# Altium project keyboard.PrjPcb
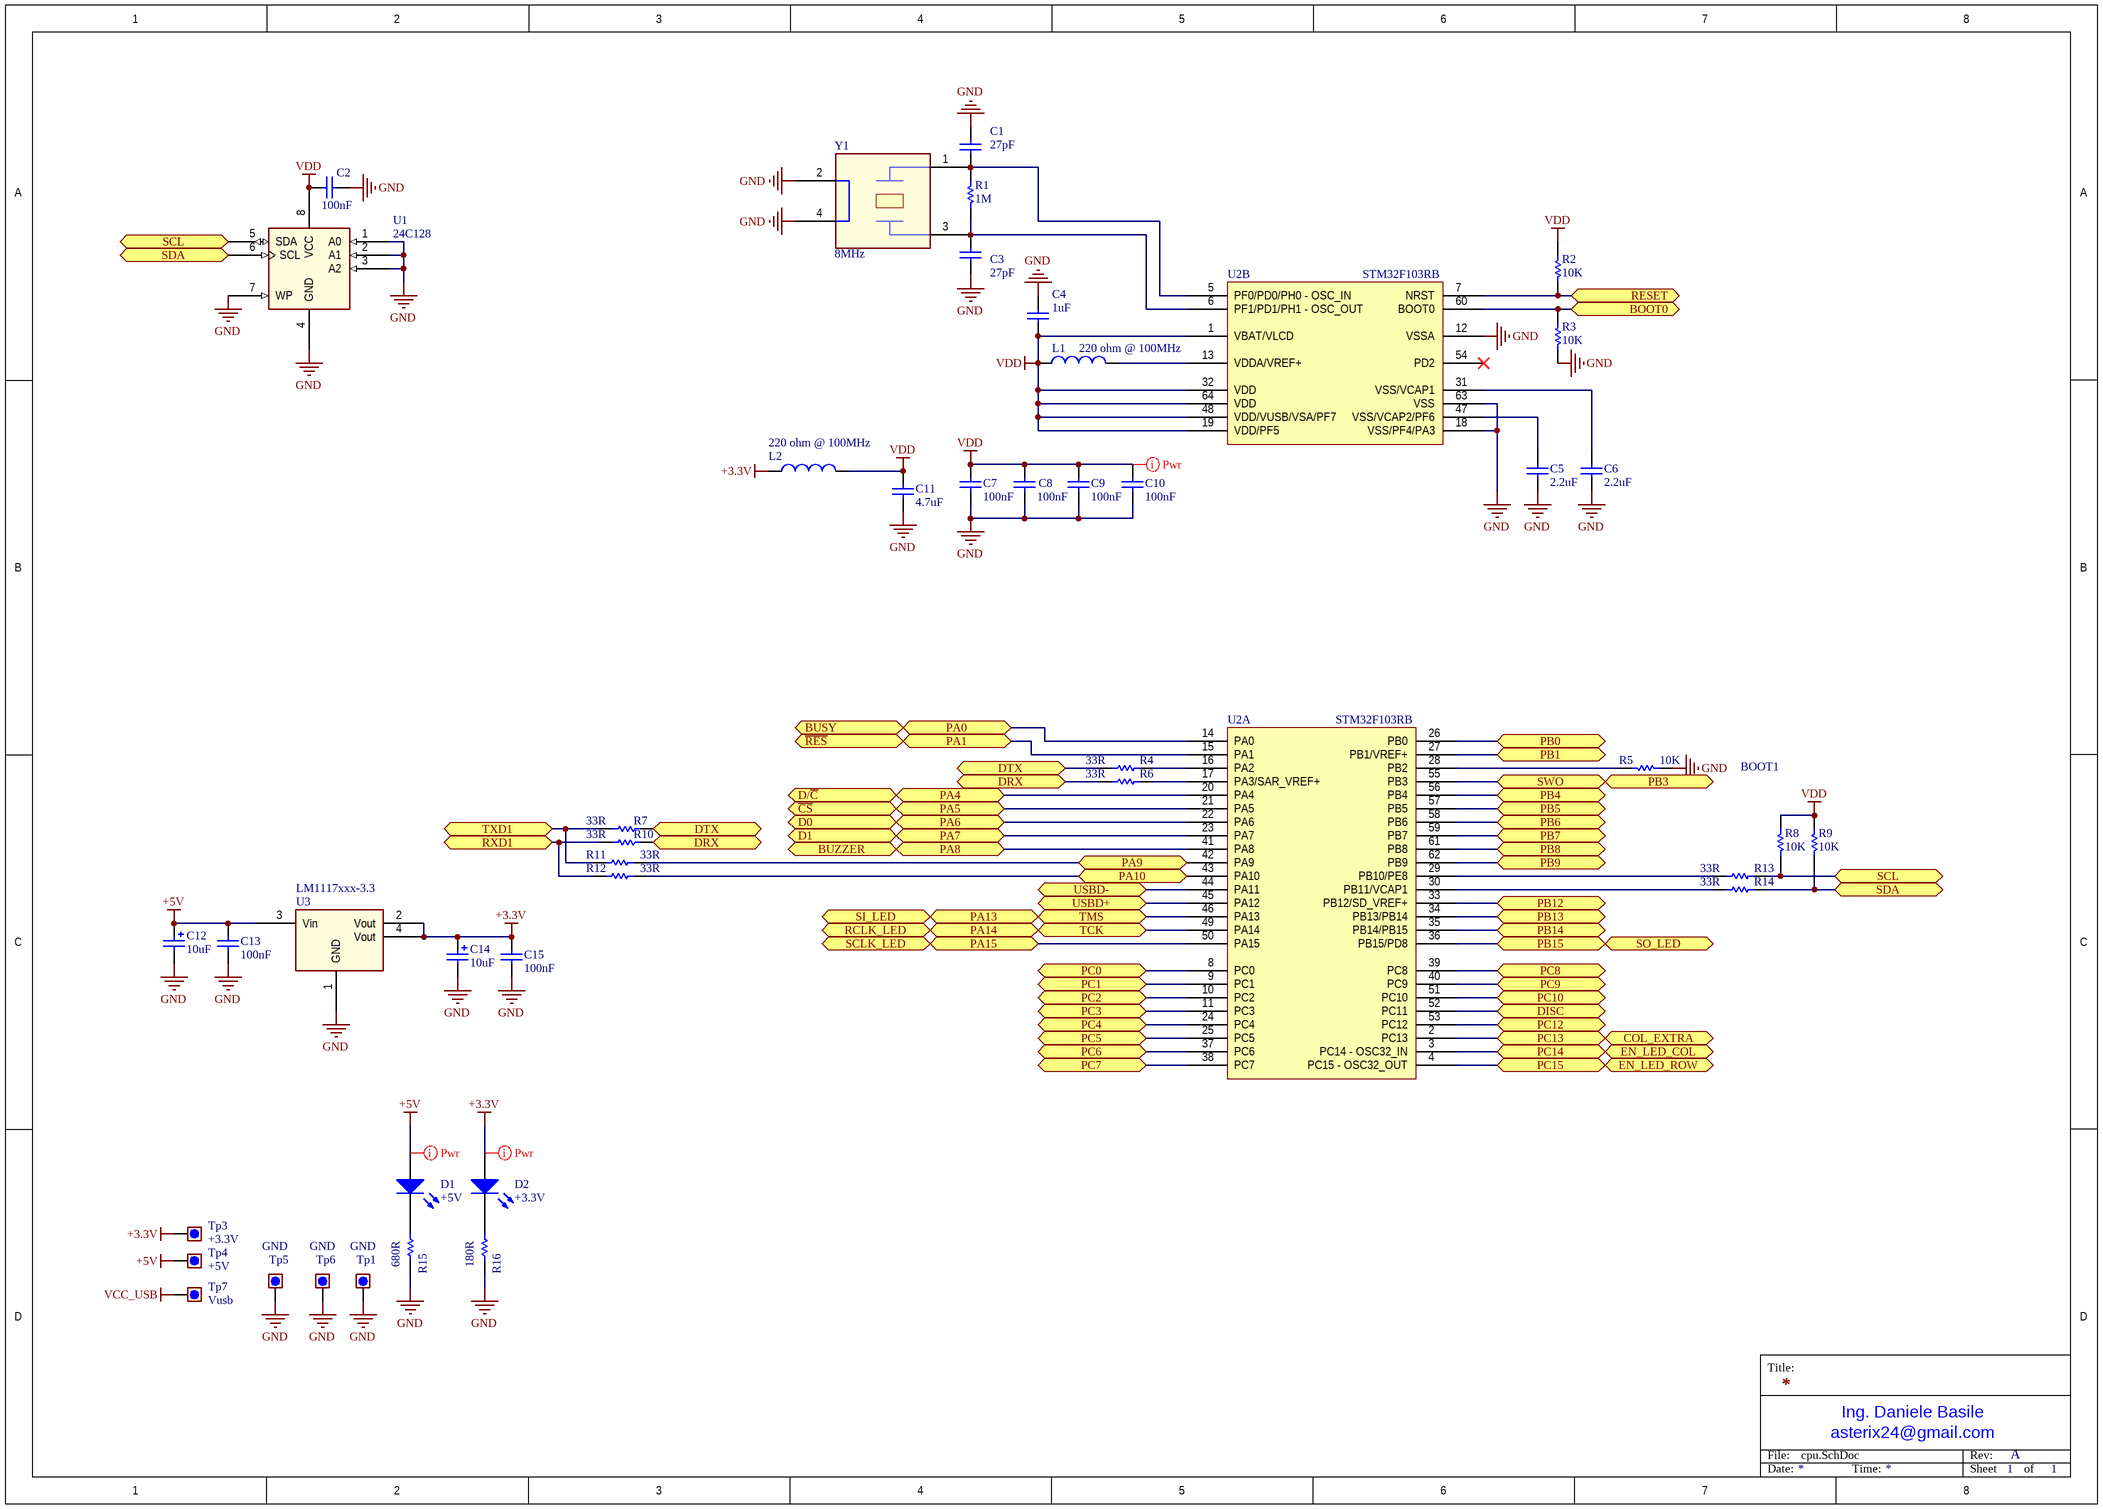
[diagram p0: cpu.SchDoc]
3 sheets, 187 parts. Net scope: flat (ports and power ports of the same name join across sheets).
Board file: keyboard.PcbDoc
Sheets:
  cpu.SchDoc
  keymap.SchDoc
  led.SchDoc

## Sheet cpu.SchDoc
size A3; Organization: Develer s.r.l.; Address1: via Mugellese 1/A; Address2: 50019 Campi Bisenzio; Address3: Firenze; Address4: ITALY; Revision: A; SheetNumber: 1; SheetTotal: 1

### Parts
C1  27pF  [0603_[1608]]
C2  100nF  [0603_[1608]]
C3  27pF  [0603_[1608]]
C4  1uF  [0603_[1608]]
C5  2.2uF  [0603_[1608]]
C6  2.2uF  [0603_[1608]]
C7  100nF  [0603_[1608]]
C8  100nF  [0603_[1608]]
C9  100nF  [0603_[1608]]
C10  100nF  [0603_[1608]]
C11  4.7uF  [0603_[1608]]
C12  10uF  [1206_[3216]]
C13  100nF  [0603_[1608]]
C14  10uF  [1206_[3216]]
C15  100nF  [0603_[1608]]
D1  +5V  [0603_[1608]_K2-A1_LED]
D2  +3.3V  [0603_[1608]_K2-A1_LED]
L1  220 ohm @ 100MHz  [0805_[2012]]
L2  220 ohm @ 100MHz  [0805_[2012]]
R1  1M  [0603_[1608]]
R2  10K  [0603_[1608]]
R3  10K  [0603_[1608]]
R4  33R  [0603_[1608]]
R5  10K  [0603_[1608]]
R6  33R  [0603_[1608]]
R7  33R  [0603_[1608]]
R8  10K  [0603_[1608]]
R9  10K  [0603_[1608]]
R10  33R  [0603_[1608]]
R11  33R  [0603_[1608]]
R12  33R  [0603_[1608]]
R13  33R  [0603_[1608]]
R14  33R  [0603_[1608]]
R15  680R  [0603_[1608]]
R16  180R  [0603_[1608]]
Tp1  GND  [TEST_POINT_THD_D1.8MM]  (no BOM)
Tp3  +3.3V  [TEST_POINT_THD_D1.8MM]  (no BOM)
Tp4  +5V  [TEST_POINT_THD_D1.8MM]  (no BOM)
Tp5  GND  [TEST_POINT_THD_D1.8MM]  (no BOM)
Tp6  GND  [TEST_POINT_THD_D1.8MM]  (no BOM)
Tp7  Vusb  [TEST_POINT_THD_D1.8MM]  (no BOM)
U1  24C128  [SOIC8]
U2  STM32F103RB  [TSQFP50P1200X1200X160-64N]  (parts A,B of 2)
U3  LM1117xxx-3.3  [SOT-223]
Y1  8MHz  [CRYSTAL_3.2X2.5MM_4P_SMD]

### Ports
BOOT0, BUSY, BUZZER, COL_EXTRA, D0, D1, D/~{C}, DISC, DRX, DTX, EN_LED_COL, EN_LED_ROW, PA0, PA1, PA4, PA5, PA6, PA7, PA8, PA9, PA10, PA13, PA14, PA15, PB0, PB1, PB3, PB4, PB5, PB6, PB7, PB8, PB9, PB12, PB13, PB14, PB15, PC0, PC1, PC2, PC3, PC4, PC5, PC6, PC7, PC8, PC9, PC10, PC12, PC13, PC14, PC15, RCLK_LED, RESET, RXD1, SCL, SCLK_LED, SDA, SI_LED, SO_LED, SWO, TCK, TMS, TXD1, USBD+, USBD-, ~{CS}, ~{RES}

### Nets
+3.3V: C14.1 C15.2 D2.1(A) L2.1 Tp3.1 U3.2(Vout) U3.4(Vout)
+5V: C12.1 C13.2 D1.1(A) Tp4.1 U3.3(Vin)
GND: C1.2 C2.1 C3.2 C4.2 C5.1 C6.1 C7.2 C8.2 C9.2 C10.2 C11.1 C12.2 C13.1 C14.2 C15.1 R3.1 R5.2 R15.1 R16.1 Tp1.1 Tp5.1 Tp6.1 U1.1(A0) U1.2(A1) U1.3(A2) U1.4(GND) U1.7(WP) U2.12(VSSA) U2.18(VSS/PF4/PA3) U2.63(VSS) U3.1(GND) Y1.2 Y1.4
VCC_USB: Tp7.1
VDD: C2.2 C4.1 C7.1 C8.1 C9.1 C10.1 C11.2 L1.1 L2.2 R2.1 R8.2 R9.2 U1.8(VCC) U2.1(VBAT/VLCD) U2.19(VDD/PF5) U2.32(VDD) U2.48(VDD/VUSB/VSA/PF7) U2.64(VDD)
BOOT0: R3.2 U2.60(BOOT0) ; port BOOT0
BUSY: U2.14(PA0) ; port PA0, port BUSY
BUZZER: U2.41(PA8) ; port PA8, port BUZZER
~{CS}: U2.21(PA5) ; port PA5, port ~{CS}
COL_EXTRA: U2.2(PC13) ; port PC13, port COL_EXTRA
D0: U2.22(PA6) ; port PA6, port D0
D1: U2.23(PA7) ; port PA7, port D1
D/~{C}: U2.20(PA4) ; port PA4, port D/~{C}
DISC: U2.52(PC11) ; port DISC
DRX: R6.2 R10.1 ; port DRX
DTX: R4.2 R7.1 ; port DTX
EN_LED_COL: U2.3(PC14_-_OSC32_IN) ; port PC14, port EN_LED_COL
EN_LED_ROW: U2.4(PC15_-_OSC32_OUT) ; port PC15, port EN_LED_ROW
PA1: U2.15(PA1) ; port PA1, port ~{RES}
PA9: R11.1 U2.42(PA9) ; port PA9
PA10: R12.1 U2.43(PA10) ; port PA10
PA13: U2.46(PA13) ; port TMS, port PA13, port SI_LED
PA14: U2.49(PA14) ; port TCK, port PA14, port RCLK_LED
PA15: U2.50(PA15) ; port PA15, port SCLK_LED
PB0: U2.26(PB0) ; port PB0
PB1: U2.27(PB1/VREF+) ; port PB1
PB3: U2.55(PB3) ; port SWO, port PB3
PB4: U2.56(PB4) ; port PB4
PB5: U2.57(PB5) ; port PB5
PB6: U2.58(PB6) ; port PB6
PB7: U2.59(PB7) ; port PB7
PB8: U2.61(PB8) ; port PB8
PB9: U2.62(PB9) ; port PB9
PB12: U2.33(PB12/SD_VREF+) ; port PB12
PB13: U2.34(PB13/PB14) ; port PB13
PB14: U2.35(PB14/PB15) ; port PB14
PB15: U2.36(PB15/PD8) ; port PB15, port SO_LED
PC0: U2.8(PC0) ; port PC0
PC1: U2.9(PC1) ; port PC1
PC2: U2.10(PC2) ; port PC2
PC3: U2.11(PC3) ; port PC3
PC4: U2.24(PC4) ; port PC4
PC5: U2.25(PC5) ; port PC5
PC6: U2.37(PC6) ; port PC6
PC7: U2.38(PC7) ; port PC7
PC8: U2.39(PC8) ; port PC8
PC9: U2.40(PC9) ; port PC9
PC10: U2.51(PC10) ; port PC10
PC12: U2.53(PC12) ; port PC12
RESET: R2.2 U2.7(NRST) ; port RESET
RXD1: R10.2 R12.2 ; port RXD1
SCL: R8.1 R13.1 U1.5(SDA) ; port SCL
SDA: R9.1 R14.1 U1.6(SCL) ; port SDA
TXD1: R7.2 R11.2 ; port TXD1
USBD+: U2.45(PA12) ; port USBD+
USBD-: U2.44(PA11) ; port USBD-
NetC1_1: C1.1 R1.2 U2.5(PF0/PD0/PH0_-_OSC_IN) Y1.1
NetC3_1: C3.1 R1.1 U2.6(PF1/PD1/PH1_-_OSC_OUT) Y1.3
NetC5_2: C5.2 U2.47(VSS/VCAP2/PF6)
NetC6_2: C6.2 U2.31(VSS/VCAP1)
NetD1_2: D1.2(K) R15.2
NetD2_2: D2.2(K) R16.2
NetL1_2: L1.2 U2.13(VDDA/VREF+)
NetR4_1: R4.1 U2.16(PA2)
NetR5_1: R5.1 U2.28(PB2)
NetR6_1: R6.1 U2.17(PA3/SAR_VREF+)
NetR13_2: R13.2 U2.29(PB10/PE8)
NetR14_2: R14.2 U2.30(PB11/VCAP1)

Not connected (* = marked no-connect by the designer): U2 54(PD2)*

### Layout directives
net class Power: +3.3V, +5V, VDD

### Notes on the sheet
- BOOT1
- Title:
- File:
- asterix24@gmail.com
- Ing. Daniele Basile
- Rev:
- Date:
- Time:
- Sheet
- of

### Library data of the parts
C1 C3 = Cap: Ceramic NP0 +/- 0.1; Value: 10nF; Published: 8-Jun-2000; Revision: July-2002: Re-released for DXP Platform.; Publisher: Altium Limited
C2 C7-C10 = Cap: Ceramic X7R 50V; Value: 10nF; Published: 8-Jun-2000; Revision: July-2002: Re-released for DXP Platform.; Publisher: Altium Limited
C4 C11 = Cap: Ceramic X7R 16V; Value: 10nF; Published: 8-Jun-2000; Revision: July-2002: Re-released for DXP Platform.; Publisher: Altium Limited
C5 C6 = Cap: Ceramic 6.3V X7R; Value: 10nF; Published: 8-Jun-2000; Revision: July-2002: Re-released for DXP Platform.; Publisher: Altium Limited
C12 C14 = Cap Pol1: Ceramic X5R 25V; Published: 8-Jun-2000; Revision: July-2002: Re-released for DXP Platform.; Publisher: Altium Limited; Value: 10uF
C13 C15 = Cap: Ceramic X7R 50V; Value: 100pF; Published: 8-Jun-2000; LatestRevisionDate: 17-Jul-2002; LatestRevisionNote: Re-released for DXP Platform.; PackageReference: RAD-0.3; Publisher: Altium Limited; PackageDescription: Radial Cap, Thru-Hole; 2 Leads; 0.3 in Pin Spacing
D1 D2 = LED0: LED Green; Published: 8-Jun-2000; LatestRevisionDate: 08-Jul-2005; LatestRevisionNote: Mech Layer 1 removed.; PackageReference: LED-0; Publisher: Altium Limited; PackageDescription: LED; 2 Leads
L1 = Inductor: Value: 100uH; Published: 8-Jun-2000; Revision: July-2002: Re-released for DXP Platform.; Publisher: Altium Limited
L2 = Inductor: WE 742792022
R1-R14 = Res1: Resistor; Value: 1K; Published: 8-Jun-2000; Revision: July-2002: Re-released for DXP Platform.; Publisher: Altium Limited
R15 R16 = Res1: Resistor; Revision: July-2002: Re-released for DXP Platform.
Tp1 Tp3-Tp7 = Test_point: Test point
U1 = EEPROM-SOIC8: EEPROM
U3 = LM1117-FIXED-OUT: LM1117 LDO Fixed output
Y1 = CRYSTAL-4p

## Sheet keymap.SchDoc
size A3; Organization: Develer s.r.l.; Address1: via Mugellese 1/A; Address2: 50019 Campi Bisenzio; Address3: Firenze; Address4: ITALY; Revision: A; SheetNumber: 1; SheetTotal: 1
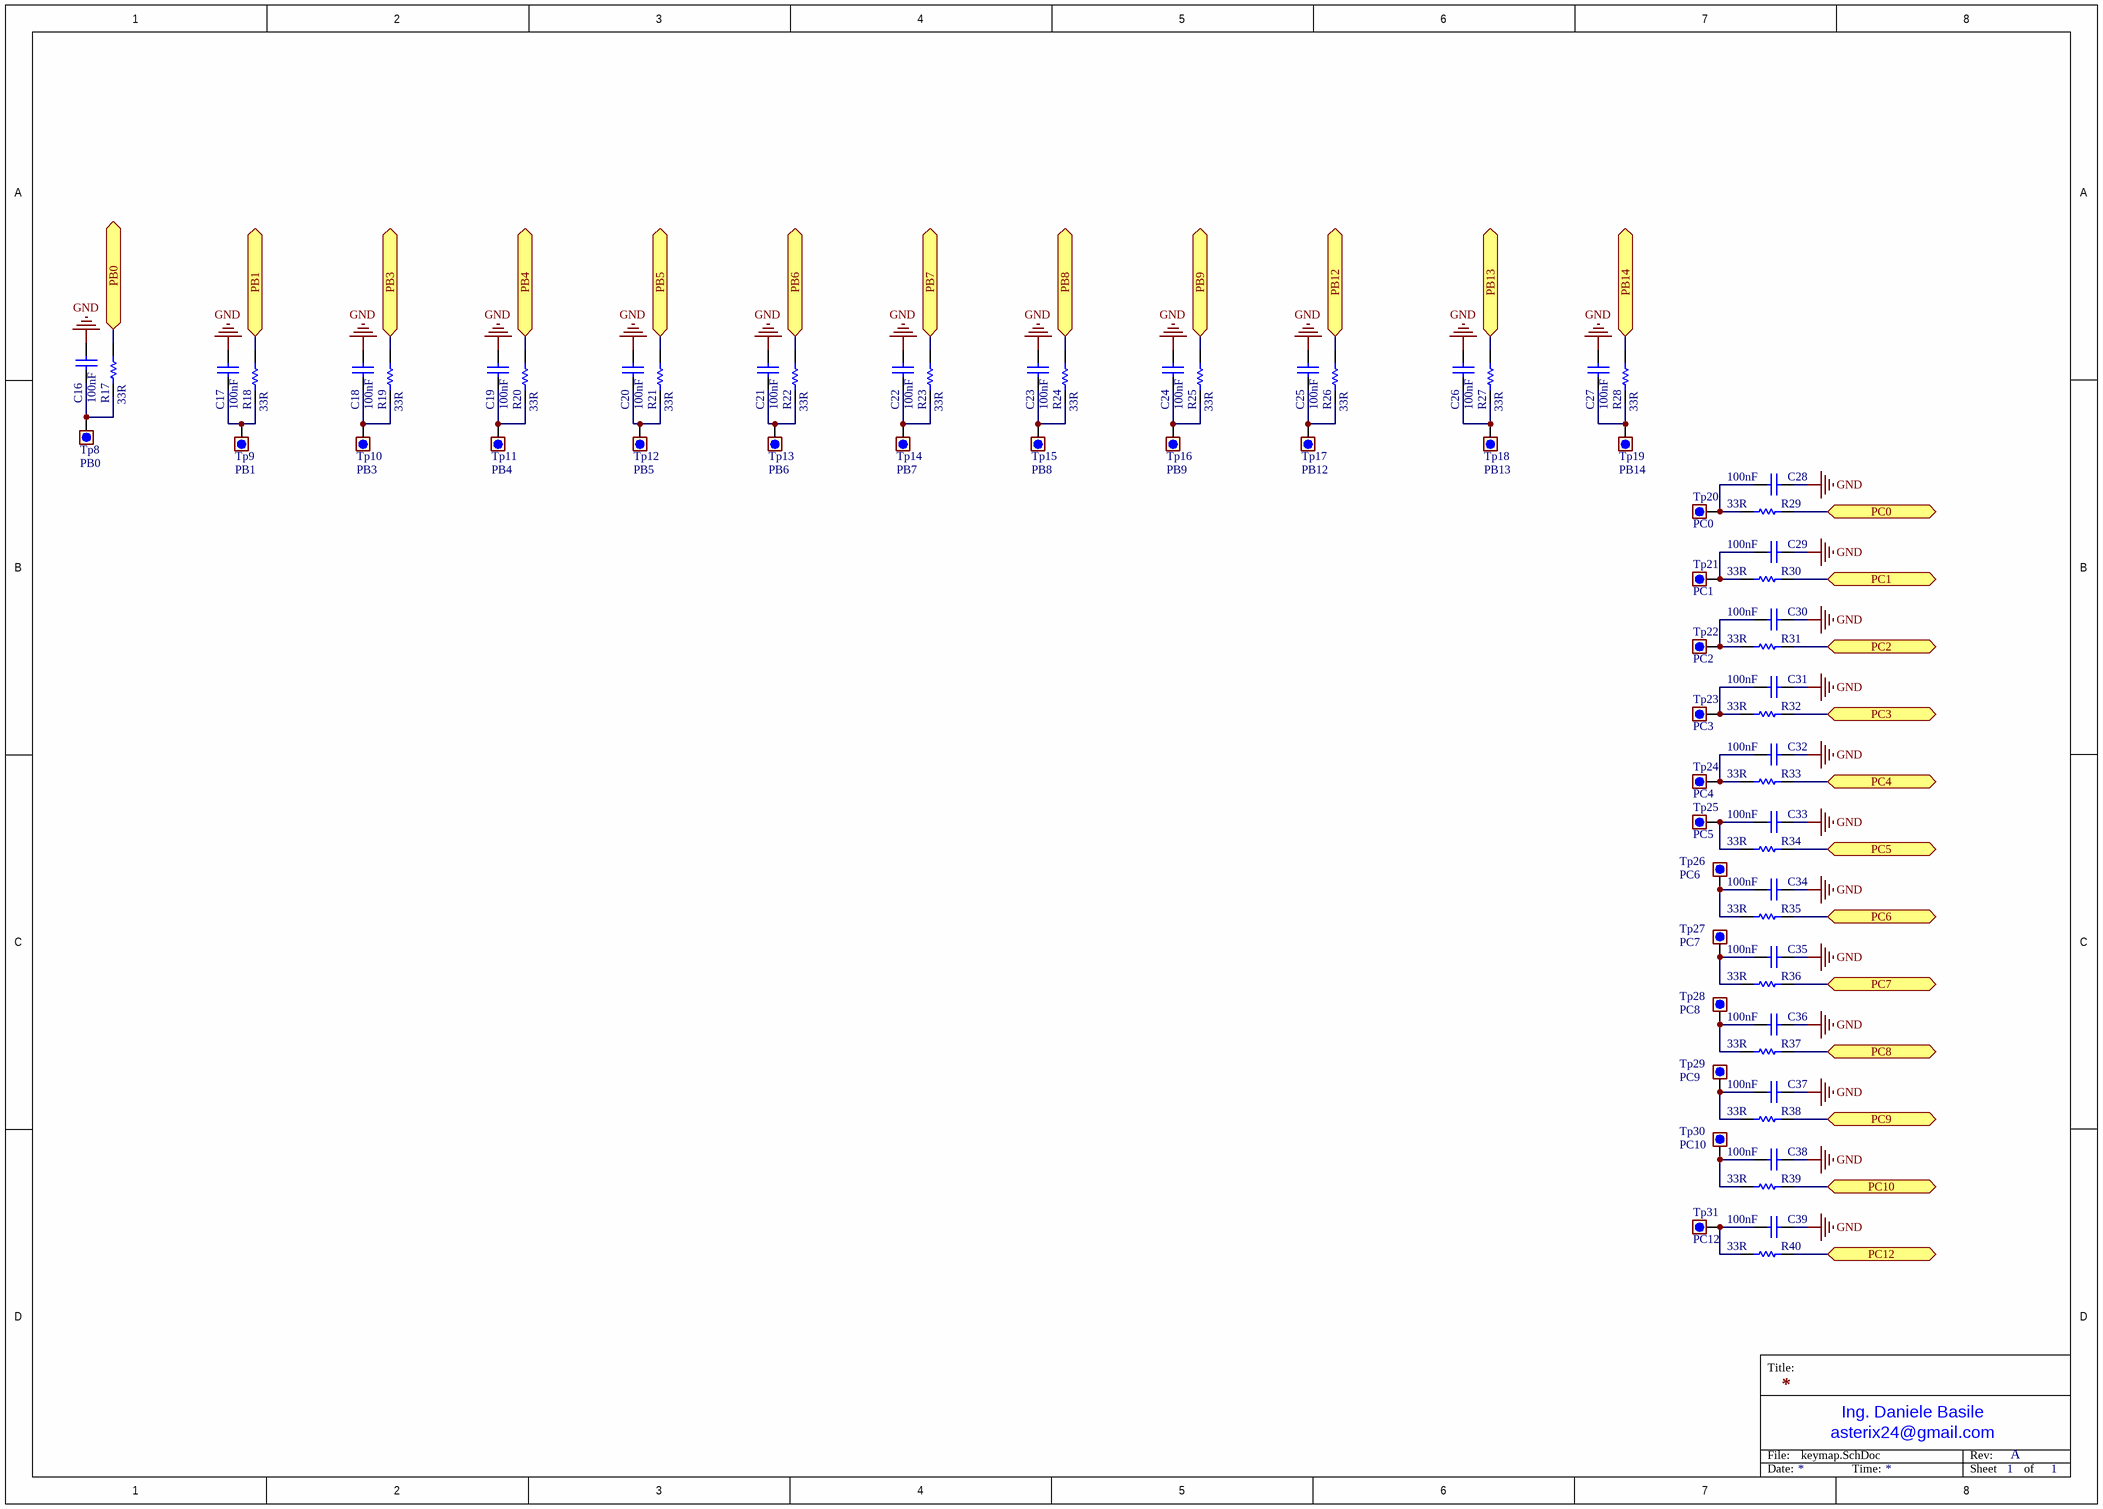
[diagram p1: keymap.SchDoc]

### Parts
C16  100nF  [0603_[1608]]
C17  100nF  [0603_[1608]]
C18  100nF  [0603_[1608]]
C19  100nF  [0603_[1608]]
C20  100nF  [0603_[1608]]
C21  100nF  [0603_[1608]]
C22  100nF  [0603_[1608]]
C23  100nF  [0603_[1608]]
C24  100nF  [0603_[1608]]
C25  100nF  [0603_[1608]]
C26  100nF  [0603_[1608]]
C27  100nF  [0603_[1608]]
C28  100nF  [0603_[1608]]
C29  100nF  [0603_[1608]]
C30  100nF  [0603_[1608]]
C31  100nF  [0603_[1608]]
C32  100nF  [0603_[1608]]
C33  100nF  [0603_[1608]]
C34  100nF  [0603_[1608]]
C35  100nF  [0603_[1608]]
C36  100nF  [0603_[1608]]
C37  100nF  [0603_[1608]]
C38  100nF  [0603_[1608]]
C39  100nF  [0603_[1608]]
R17  33R  [0603_[1608]]
R18  33R  [0603_[1608]]
R19  33R  [0603_[1608]]
R20  33R  [0603_[1608]]
R21  33R  [0603_[1608]]
R22  33R  [0603_[1608]]
R23  33R  [0603_[1608]]
R24  33R  [0603_[1608]]
R25  33R  [0603_[1608]]
R26  33R  [0603_[1608]]
R27  33R  [0603_[1608]]
R28  33R  [0603_[1608]]
R29  33R  [0603_[1608]]
R30  33R  [0603_[1608]]
R31  33R  [0603_[1608]]
R32  33R  [0603_[1608]]
R33  33R  [0603_[1608]]
R34  33R  [0603_[1608]]
R35  33R  [0603_[1608]]
R36  33R  [0603_[1608]]
R37  33R  [0603_[1608]]
R38  33R  [0603_[1608]]
R39  33R  [0603_[1608]]
R40  33R  [0603_[1608]]
Tp8  PB0  [TEST_POINT_THD_D1.6mm_oval]  (no BOM)
Tp9  PB1  [TEST_POINT_THD_D1.6mm_oval]  (no BOM)
Tp10  PB3  [TEST_POINT_THD_D1.6mm_oval]  (no BOM)
Tp11  PB4  [TEST_POINT_THD_D1.6mm_oval]  (no BOM)
Tp12  PB5  [TEST_POINT_THD_D1.6mm_oval]  (no BOM)
Tp13  PB6  [TEST_POINT_THD_D1.6mm_oval]  (no BOM)
Tp14  PB7  [TEST_POINT_THD_D1.6mm_oval]  (no BOM)
Tp15  PB8  [TEST_POINT_THD_D1.6mm_oval]  (no BOM)
Tp16  PB9  [TEST_POINT_THD_D1.6mm_oval]  (no BOM)
Tp17  PB12  [TEST_POINT_THD_D1.6mm_oval]  (no BOM)
Tp18  PB13  [TEST_POINT_THD_D1.6mm_oval]  (no BOM)
Tp19  PB14  [TEST_POINT_THD_D1.6mm_oval]  (no BOM)
Tp20  PC0  [TEST_POINT_THD_D1.6mm_oval]  (no BOM)
Tp21  PC1  [TEST_POINT_THD_D1.6mm_oval]  (no BOM)
Tp22  PC2  [TEST_POINT_THD_D1.6mm_oval]  (no BOM)
Tp23  PC3  [TEST_POINT_THD_D1.6mm_oval]  (no BOM)
Tp24  PC4  [TEST_POINT_THD_D1.6mm_oval]  (no BOM)
Tp25  PC5  [TEST_POINT_THD_D1.6mm_oval]  (no BOM)
Tp26  PC6  [TEST_POINT_THD_D1.6mm_oval]  (no BOM)
Tp27  PC7  [TEST_POINT_THD_D1.6mm_oval]  (no BOM)
Tp28  PC8  [TEST_POINT_THD_D1.6mm_oval]  (no BOM)
Tp29  PC9  [TEST_POINT_THD_D1.6mm_oval]  (no BOM)
Tp30  PC10  [TEST_POINT_THD_D1.6mm_oval]  (no BOM)
Tp31  PC12  [TEST_POINT_THD_D1.6mm_oval]  (no BOM)

### Ports
PB0, PB1, PB3, PB4, PB5, PB6, PB7, PB8, PB9, PB12, PB13, PB14, PC0, PC1, PC2, PC3, PC4, PC5, PC6, PC7, PC8, PC9, PC10, PC12

### Nets
GND: C16.2 C17.2 C18.2 C19.2 C20.2 C21.2 C22.2 C23.2 C24.2 C25.2 C26.2 C27.2 C28.2 C29.2 C30.2 C31.2 C32.2 C33.2 C34.2 C35.2 C36.2 C37.2 C38.2 C39.2
PB0: R17.2 ; port PB0
PB1: R18.2 ; port PB1
PB3: R19.2 ; port PB3
PB4: R20.2 ; port PB4
PB5: R21.2 ; port PB5
PB6: R22.2 ; port PB6
PB7: R23.2 ; port PB7
PB8: R24.2 ; port PB8
PB9: R25.2 ; port PB9
PB12: R26.2 ; port PB12
PB13: R27.2 ; port PB13
PB14: R28.2 ; port PB14
PC0: R29.2 ; port PC0
PC1: R30.2 ; port PC1
PC2: R31.2 ; port PC2
PC3: R32.2 ; port PC3
PC4: R33.2 ; port PC4
PC5: R34.2 ; port PC5
PC6: R35.2 ; port PC6
PC7: R36.2 ; port PC7
PC8: R37.2 ; port PC8
PC9: R38.2 ; port PC9
PC10: R39.2 ; port PC10
PC12: R40.2 ; port PC12
NetC16_1: C16.1 R17.1 Tp8.1
NetC17_1: C17.1 R18.1 Tp9.1
NetC18_1: C18.1 R19.1 Tp10.1
NetC19_1: C19.1 R20.1 Tp11.1
NetC20_1: C20.1 R21.1 Tp12.1
NetC21_1: C21.1 R22.1 Tp13.1
NetC22_1: C22.1 R23.1 Tp14.1
NetC23_1: C23.1 R24.1 Tp15.1
NetC24_1: C24.1 R25.1 Tp16.1
NetC25_1: C25.1 R26.1 Tp17.1
NetC26_1: C26.1 R27.1 Tp18.1
NetC27_1: C27.1 R28.1 Tp19.1
NetC28_1: C28.1 R29.1 Tp20.1
NetC29_1: C29.1 R30.1 Tp21.1
NetC30_1: C30.1 R31.1 Tp22.1
NetC31_1: C31.1 R32.1 Tp23.1
NetC32_1: C32.1 R33.1 Tp24.1
NetC33_1: C33.1 R34.1 Tp25.1
NetC34_1: C34.1 R35.1 Tp26.1
NetC35_1: C35.1 R36.1 Tp27.1
NetC36_1: C36.1 R37.1 Tp28.1
NetC37_1: C37.1 R38.1 Tp29.1
NetC38_1: C38.1 R39.1 Tp30.1
NetC39_1: C39.1 R40.1 Tp31.1

### Notes on the sheet
- Title:
- File:
- asterix24@gmail.com
- Ing. Daniele Basile
- Rev:
- Date:
- Time:
- Sheet
- of

### Library data of the parts
C16-C39 = Cap: Ceramic X7R 50V; Value: 10nF; Published: 8-Jun-2000; Revision: July-2002: Re-released for DXP Platform.; Publisher: Altium Limited
R17-R40 = Res1: Resistor; Value: 1K; Published: 8-Jun-2000; Revision: July-2002: Re-released for DXP Platform.; Publisher: Altium Limited
Tp8-Tp31 = Test_point: Test point

## Sheet led.SchDoc
size A3; Organization: Develer s.r.l.; Address1: via Mugellese 1/A; Address2: 50019 Campi Bisenzio; Address3: Firenze; Address4: ITALY; Revision: A; SheetNumber: 1; SheetTotal: 1
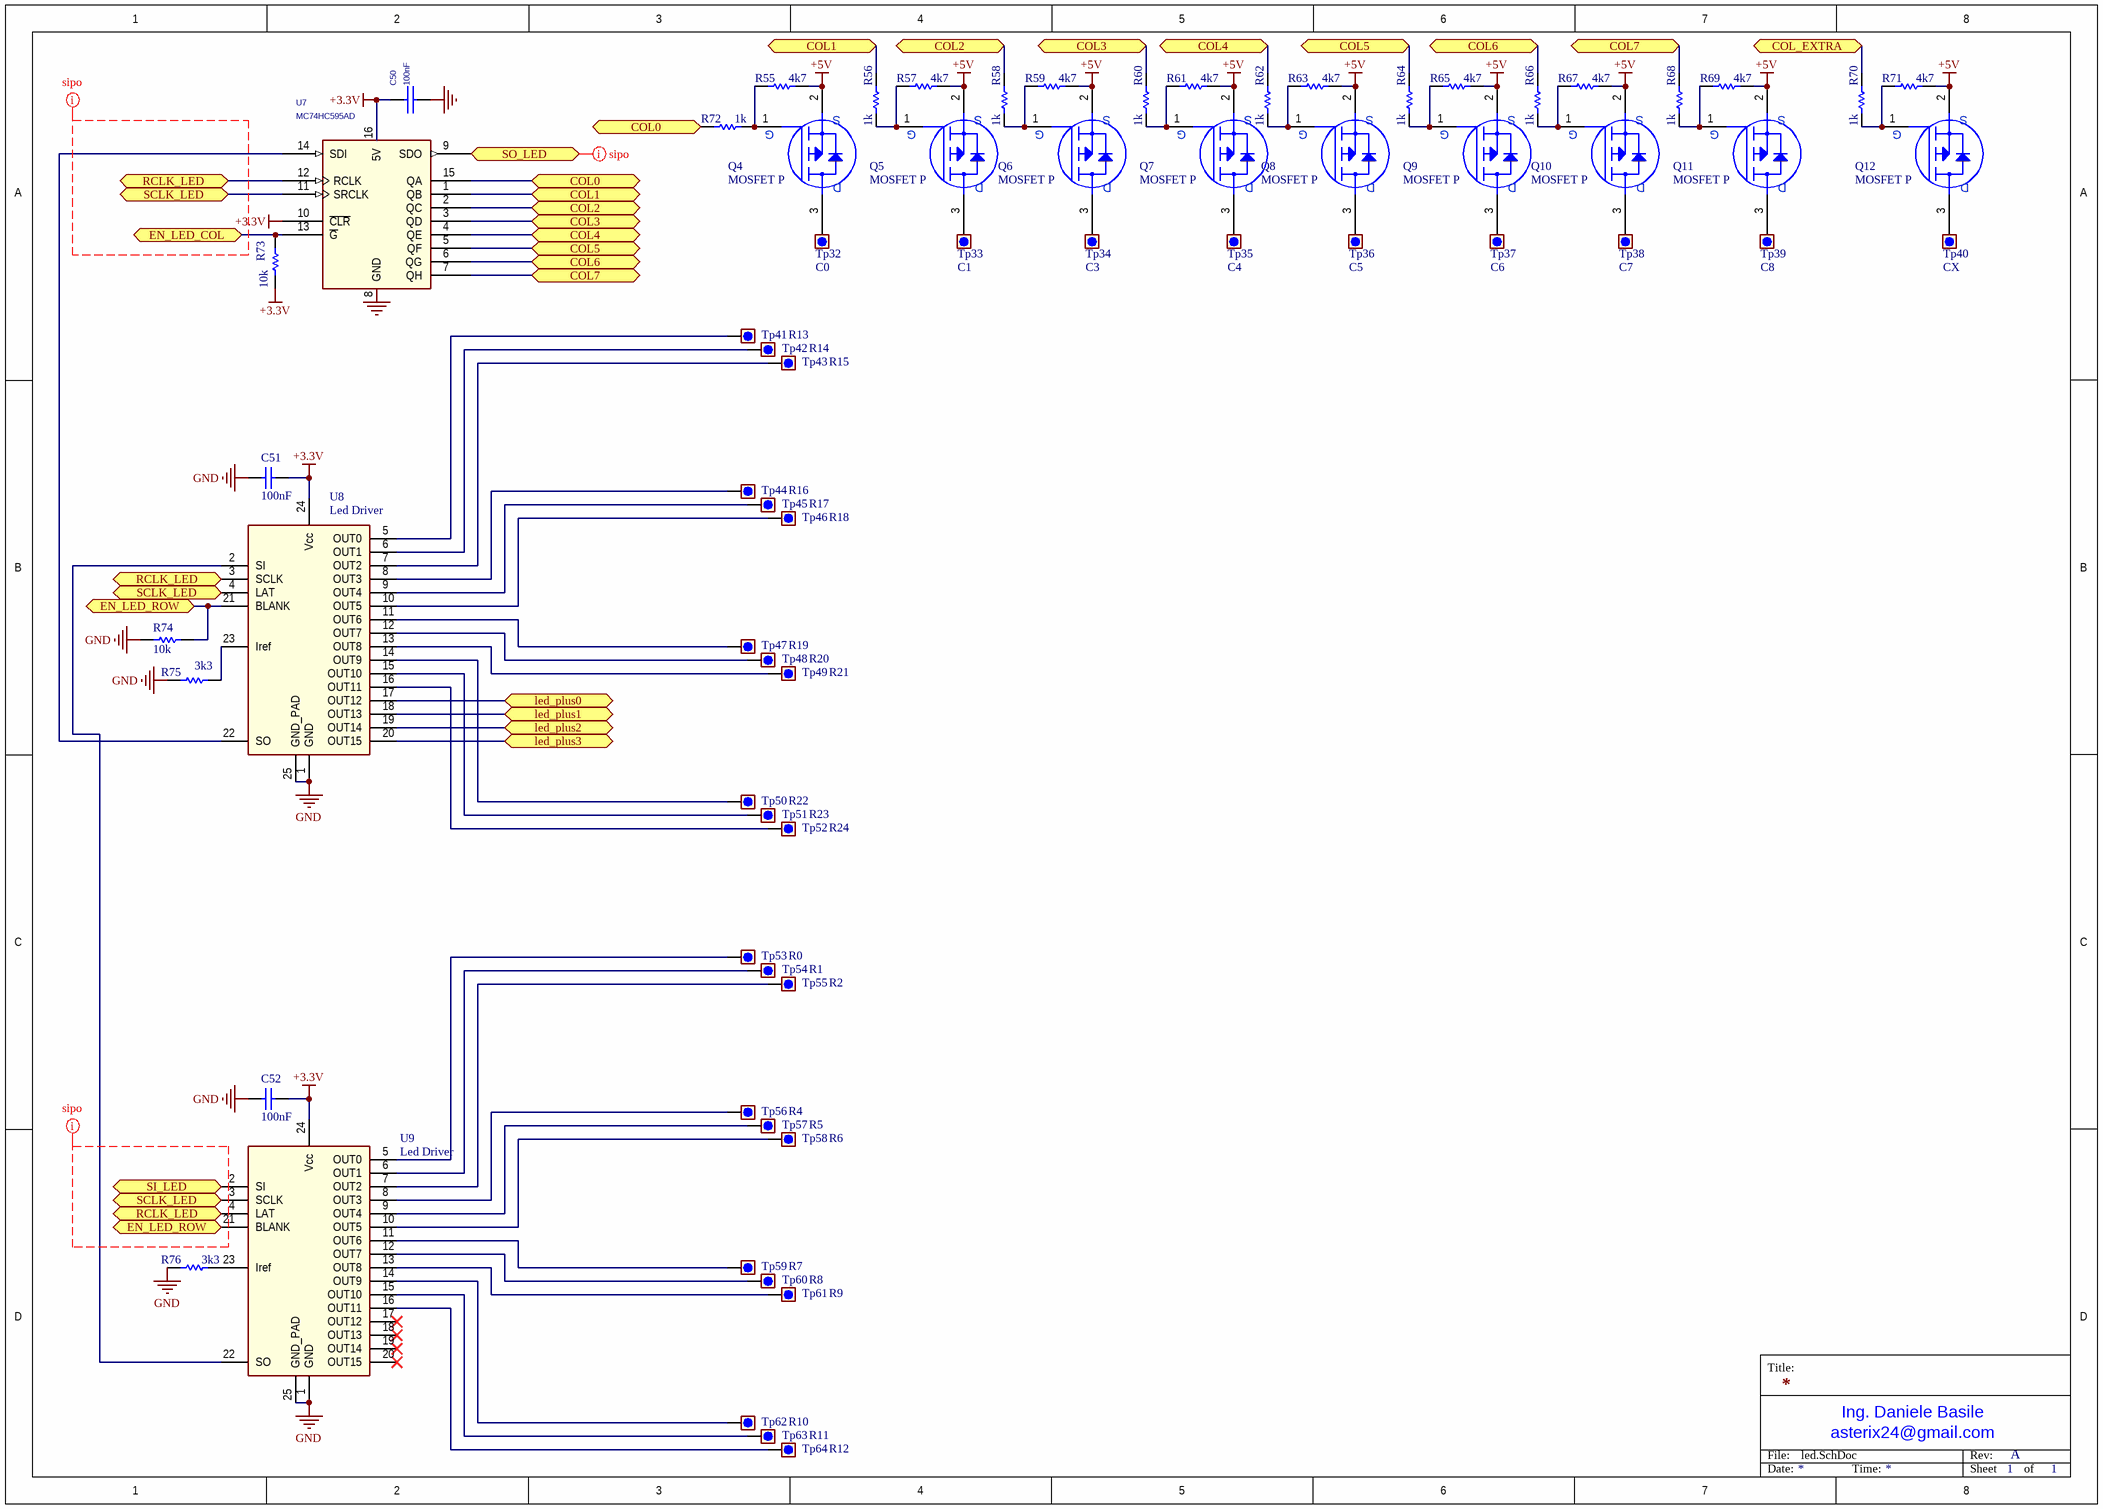
[diagram p2: led.SchDoc]

### Parts
C50  100nF  [0603_[1608]]
C51  100nF  [0603_[1608]]
C52  100nF  [0603_[1608]]
Q4  MOSFET P  [SOT-23]
Q5  MOSFET P  [SOT-23]
Q6  MOSFET P  [SOT-23]
Q7  MOSFET P  [SOT-23]
Q8  MOSFET P  [SOT-23]
Q9  MOSFET P  [SOT-23]
Q10  MOSFET P  [SOT-23]
Q11  MOSFET P  [SOT-23]
Q12  MOSFET P  [SOT-23]
R55  4k7  [0603_[1608]]
R56  1k  [0603_[1608]]
R57  4k7  [0603_[1608]]
R58  1k  [0603_[1608]]
R59  4k7  [0603_[1608]]
R60  1k  [0603_[1608]]
R61  4k7  [0603_[1608]]
R62  1k  [0603_[1608]]
R63  4k7  [0603_[1608]]
R64  1k  [0603_[1608]]
R65  4k7  [0603_[1608]]
R66  1k  [0603_[1608]]
R67  4k7  [0603_[1608]]
R68  1k  [0603_[1608]]
R69  4k7  [0603_[1608]]
R70  1k  [0603_[1608]]
R71  4k7  [0603_[1608]]
R72  1k  [0603_[1608]]
R73  10k  [0603_[1608]]
R74  10k  [0603_[1608]]
R75  3k3  [0805_[2012]]
R76  3k3  [0805_[2012]]
Tp32  C0  [TEST_POINT_THD_D1.6mm_oval]  (no BOM)
Tp33  C1  [TEST_POINT_THD_D1.6mm_oval]  (no BOM)
Tp34  C3  [TEST_POINT_THD_D1.6mm_oval]  (no BOM)
Tp35  C4  [TEST_POINT_THD_D1.6mm_oval]  (no BOM)
Tp36  C5  [TEST_POINT_THD_D1.6mm_oval]  (no BOM)
Tp37  C6  [TEST_POINT_THD_D1.6mm_oval]  (no BOM)
Tp38  C7  [TEST_POINT_THD_D1.6mm_oval]  (no BOM)
Tp39  C8  [TEST_POINT_THD_D1.6mm_oval]  (no BOM)
Tp40  CX  [TEST_POINT_THD_D1.6mm_oval]  (no BOM)
Tp41  R13  [TEST_POINT_THD_D1.6mm_oval]  (no BOM)
Tp42  R14  [TEST_POINT_THD_D1.6mm_oval]  (no BOM)
Tp43  R15  [TEST_POINT_THD_D1.6mm_oval]  (no BOM)
Tp44  R16  [TEST_POINT_THD_D1.6mm_oval]  (no BOM)
Tp45  R17  [TEST_POINT_THD_D1.6mm_oval]  (no BOM)
Tp46  R18  [TEST_POINT_THD_D1.6mm_oval]  (no BOM)
Tp47  R19  [TEST_POINT_THD_D1.6mm_oval]  (no BOM)
Tp48  R20  [TEST_POINT_THD_D1.6mm_oval]  (no BOM)
Tp49  R21  [TEST_POINT_THD_D1.6mm_oval]  (no BOM)
Tp50  R22  [TEST_POINT_THD_D1.6mm_oval]  (no BOM)
Tp51  R23  [TEST_POINT_THD_D1.6mm_oval]  (no BOM)
Tp52  R24  [TEST_POINT_THD_D1.6mm_oval]  (no BOM)
Tp53  R0  [TEST_POINT_THD_D1.6mm_oval]  (no BOM)
Tp54  R1  [TEST_POINT_THD_D1.6mm_oval]  (no BOM)
Tp55  R2  [TEST_POINT_THD_D1.6mm_oval]  (no BOM)
Tp56  R4  [TEST_POINT_THD_D1.6mm_oval]  (no BOM)
Tp57  R5  [TEST_POINT_THD_D1.6mm_oval]  (no BOM)
Tp58  R6  [TEST_POINT_THD_D1.6mm_oval]  (no BOM)
Tp59  R7  [TEST_POINT_THD_D1.6mm_oval]  (no BOM)
Tp60  R8  [TEST_POINT_THD_D1.6mm_oval]  (no BOM)
Tp61  R9  [TEST_POINT_THD_D1.6mm_oval]  (no BOM)
Tp62  R10  [TEST_POINT_THD_D1.6mm_oval]  (no BOM)
Tp63  R11  [TEST_POINT_THD_D1.6mm_oval]  (no BOM)
Tp64  R12  [TEST_POINT_THD_D1.6mm_oval]  (no BOM)
U7  MC74HC595AD  [SOIC16]
U8  Led Driver  [TSOP65P640X120_HS-25N]
U9  Led Driver  [TSOP65P640X120_HS-25N]

### Ports
COL0, COL1, COL2, COL3, COL4, COL5, COL6, COL7, COL_EXTRA, EN_LED_COL, EN_LED_ROW, led_plus0, led_plus1, led_plus2, led_plus3, RCLK_LED, SCLK_LED, SI_LED, SO_LED

### Nets
+3.3V: C50.1 C51.2 C52.2 R73.1 U7.10(~{CLR}) U7.16(5V) U8.24(Vcc) U9.24(Vcc)  [also labelled 5V]
+5V: Q4.2(S) Q5.2(S) Q6.2(S) Q7.2(S) Q8.2(S) Q9.2(S) Q10.2(S) Q11.2(S) Q12.2(S) R55.1 R57.1 R59.1 R61.1 R63.1 R65.1 R67.1 R69.1 R71.1
GND: C50.2 C51.1 C52.1 R74.1 R75.1 R76.1 U7.8(GND) U8.1(GND) U8.25(GND_PAD) U9.1(GND) U9.25(GND_PAD)
COL0: R72.2 U7.15(QA) ; port COL0
COL1: R56.1 U7.1(QB) ; port COL1
COL2: R58.1 U7.2(QC) ; port COL2
COL3: R60.1 U7.3(QD) ; port COL3
COL4: R62.1 U7.4(QE) ; port COL4
COL5: R64.1 U7.5(QF) ; port COL5
COL6: R66.1 U7.6(QG) ; port COL6
COL7: R68.1 U7.7(QH) ; port COL7
COL_EXTRA: R70.1 ; port COL_EXTRA
EN_LED_COL: R73.2 U7.13(~{G}) ; port EN_LED_COL
EN_LED_ROW: R74.2 U8.21(BLANK) U9.21(BLANK) ; port EN_LED_ROW
led_plus0: U8.17(OUT12) ; port led_plus0
led_plus1: U8.18(OUT13) ; port led_plus1
led_plus2: U8.19(OUT14) ; port led_plus2
led_plus3: U8.20(OUT15) ; port led_plus3
PA13: U9.2(SI) ; port SI_LED
PA14: U7.12(RCLK) U8.3(SCLK) U9.4(LAT) ; port RCLK_LED
PA15: U7.11(SRCLK) U8.4(LAT) U9.3(SCLK) ; port SCLK_LED
PB15: U7.9(SDO) ; port SO_LED
NetQ4_1: Q4.1(G) R55.2 R72.1
NetQ4_3: Q4.3(D) Tp32.1
NetQ5_1: Q5.1(G) R56.2 R57.2
NetQ5_3: Q5.3(D) Tp33.1
NetQ6_1: Q6.1(G) R58.2 R59.2
NetQ6_3: Q6.3(D) Tp34.1
NetQ7_1: Q7.1(G) R60.2 R61.2
NetQ7_3: Q7.3(D) Tp35.1
NetQ8_1: Q8.1(G) R62.2 R63.2
NetQ8_3: Q8.3(D) Tp36.1
NetQ9_1: Q9.1(G) R64.2 R65.2
NetQ9_3: Q9.3(D) Tp37.1
NetQ10_1: Q10.1(G) R66.2 R67.2
NetQ10_3: Q10.3(D) Tp38.1
NetQ11_1: Q11.1(G) R68.2 R69.2
NetQ11_3: Q11.3(D) Tp39.1
NetQ12_1: Q12.1(G) R70.2 R71.2
NetQ12_3: Q12.3(D) Tp40.1
NetR75_2: R75.2 U8.23(Iref)
NetR76_2: R76.2 U9.23(Iref)
NetTp41_1: Tp41.1 U8.5(OUT0)
NetTp42_1: Tp42.1 U8.6(OUT1)
NetTp43_1: Tp43.1 U8.7(OUT2)
NetTp44_1: Tp44.1 U8.8(OUT3)
NetTp45_1: Tp45.1 U8.9(OUT4)
NetTp46_1: Tp46.1 U8.10(OUT5)
NetTp47_1: Tp47.1 U8.11(OUT6)
NetTp48_1: Tp48.1 U8.12(OUT7)
NetTp49_1: Tp49.1 U8.13(OUT8)
NetTp50_1: Tp50.1 U8.14(OUT9)
NetTp51_1: Tp51.1 U8.15(OUT10)
NetTp52_1: Tp52.1 U8.16(OUT11)
NetTp53_1: Tp53.1 U9.5(OUT0)
NetTp54_1: Tp54.1 U9.6(OUT1)
NetTp55_1: Tp55.1 U9.7(OUT2)
NetTp56_1: Tp56.1 U9.8(OUT3)
NetTp57_1: Tp57.1 U9.9(OUT4)
NetTp58_1: Tp58.1 U9.10(OUT5)
NetTp59_1: Tp59.1 U9.11(OUT6)
NetTp60_1: Tp60.1 U9.12(OUT7)
NetTp61_1: Tp61.1 U9.13(OUT8)
NetTp62_1: Tp62.1 U9.14(OUT9)
NetTp63_1: Tp63.1 U9.15(OUT10)
NetTp64_1: Tp64.1 U9.16(OUT11)
NetU7_14: U7.14(SDI) U8.22(SO)
NetU8_2: U8.2(SI) U9.22(SO)

Not connected (* = marked no-connect by the designer): U9 17(OUT12)* 18(OUT13)* 19(OUT14)* 20(OUT15)*

### Layout directives
net class sipo: (no net found under the mark), PB15

### Notes on the sheet
- Title:
- File:
- asterix24@gmail.com
- Ing. Daniele Basile
- Rev:
- Date:
- Time:
- Sheet
- of

### Library data of the parts
C50 = C: CER 50V X7R
C51 C52 = Cap: Ceramic X7R 50V; Value: 10nF; Published: 8-Jun-2000; Revision: July-2002: Re-released for DXP Platform.; Publisher: Altium Limited
Q4 = MOSFET-P 3pin: IRLML5103TRPbF; DMG1013UW;
Q5-Q12 = MOSFET-P 3pin
R55 R57 R59 R61 R63 R65 R67 R69 R71 R73-R76 = Res1: Resistor; Value: 1K; Published: 8-Jun-2000; Revision: July-2002: Re-released for DXP Platform.; Publisher: Altium Limited
R56 R58 R60 R62 R64 R66 R68 R70 R72 = Res1: Resistor; Published: 8-Jun-2000; Revision: July-2002: Re-released for DXP Platform.; Publisher: Altium Limited; Value: 1K
Tp32-Tp64 = Test_point: Test point
U7 = 74HC595_27: 8-Bit Serial-Input/Serial or Prallel-Output Shift Register with Latched 3-State Outputs
U8 U9 = Led_driver: (Texas TLC5928; ST STP16CP05)

## Nets that join several sheets
+3.3V: cpu (7 pins), led (8 pins)
+5V: cpu (5 pins), led (18 pins)
GND: cpu (33 pins), keymap (24 pins), led (11 pins)
COL_EXTRA: cpu (U2.2), led (R70.1)
EN_LED_COL: cpu (U2.3), led (R73.2 U7.13)
EN_LED_ROW: cpu (U2.4), led (R74.2 U8.21 U9.21)
PA13: cpu (U2.46), led (U9.2)
PA14: cpu (U2.49), led (U7.12 U8.3 U9.4)
PA15: cpu (U2.50), led (U7.11 U8.4 U9.3)
PB0: cpu (U2.26), keymap (R17.2)
PB1: cpu (U2.27), keymap (R18.2)
PB3: cpu (U2.55), keymap (R19.2)
PB4: cpu (U2.56), keymap (R20.2)
PB5: cpu (U2.57), keymap (R21.2)
PB6: cpu (U2.58), keymap (R22.2)
PB7: cpu (U2.59), keymap (R23.2)
PB8: cpu (U2.61), keymap (R24.2)
PB9: cpu (U2.62), keymap (R25.2)
PB12: cpu (U2.33), keymap (R26.2)
PB13: cpu (U2.34), keymap (R27.2)
PB14: cpu (U2.35), keymap (R28.2)
PB15: cpu (U2.36), led (U7.9)
PC0: cpu (U2.8), keymap (R29.2)
PC1: cpu (U2.9), keymap (R30.2)
PC2: cpu (U2.10), keymap (R31.2)
PC3: cpu (U2.11), keymap (R32.2)
PC4: cpu (U2.24), keymap (R33.2)
PC5: cpu (U2.25), keymap (R34.2)
PC6: cpu (U2.37), keymap (R35.2)
PC7: cpu (U2.38), keymap (R36.2)
PC8: cpu (U2.39), keymap (R37.2)
PC9: cpu (U2.40), keymap (R38.2)
PC10: cpu (U2.51), keymap (R39.2)
PC12: cpu (U2.53), keymap (R40.2)